# Altium schematic sheet 11_MEM_HYPERRAM_FLASH.SchDoc
size A3; DocumentNumber: 11; SheetNumber: 11; SheetTotal: 21
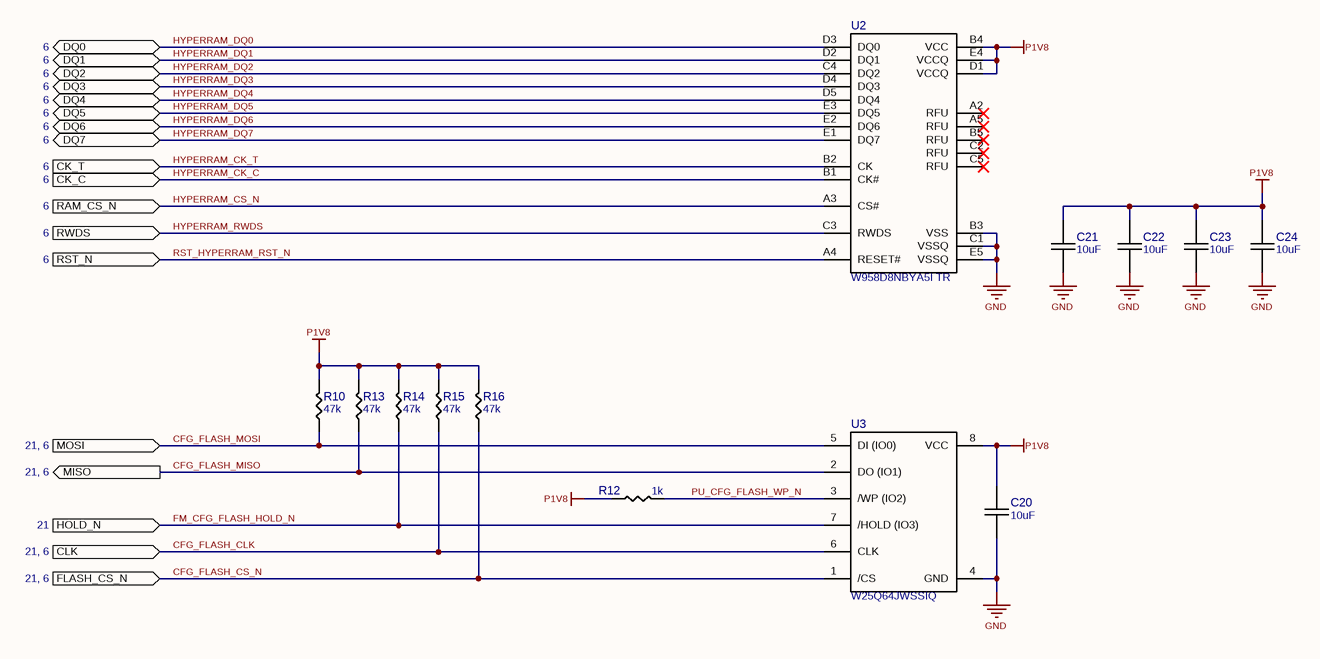
[diagram p0: 11_MEM_HYPERRAM_FLASH.SchDoc]

## Parts
C20  10uF  [CAPC1005X06N]
C21  10uF  [CAPC1005X06N]
C22  10uF  [CAPC1005X06N]
C23  10uF  [CAPC1005X06N]
C24  10uF  [CAPC1005X06N]
R10  47k  [RESC1005X03N]
R12  1k  [RESC1005X03N]
R13  47k  [RESC1005X03N]
R14  47k  [RESC1005X03N]
R15  47k  [RESC1005X03N]
R16  47k  [RESC1005X03N]
U2  W958D8NBYA5I TR  [BGA24C100P5X5_600X800X120]
U3  W25Q64JWSSIQ  [SOIC127P590X175-8N]

## Ports
CK_C (in, see 6), CK_T (in, see 6), CLK (in, see 21, 6), DQ0 (bidir, see 6), DQ1 (bidir, see 6), DQ2 (bidir, see 6), DQ3 (bidir, see 6), DQ4 (bidir, see 6), DQ5 (bidir, see 6), DQ6 (bidir, see 6), DQ7 (bidir, see 6), FLASH_CS_N (in, see 21, 6), HOLD_N (in, see 21), MISO (out, see 21, 6), MOSI (in, see 21, 6), RAM_CS_N (in, see 6), RST_N (in, see 6), RWDS (in, see 6)

## Nets
GND: C20.1 C21.1 C22.1 C23.1 C24.1 U2.B3(VSS) U2.C1(VSSQ) U2.E5(VSSQ) U3.4(GND)
P1V8: C20.2 C21.2 C22.2 C23.2 C24.2 R10.2 R12.1 R13.2 R14.2 R15.2 R16.2 U2.B4(VCC) U2.D1(VCCQ) U2.E4(VCCQ) U3.8(VCC)
CFG_FLASH_CLK: R15.1 U3.6(CLK) ; port CLK
CFG_FLASH_CS_N: R16.1 U3.1(/CS) ; port FLASH_CS_N
CFG_FLASH_MISO: R13.1 U3.2(DO_(IO1)) ; port MISO
CFG_FLASH_MOSI: R10.1 U3.5(DI_(IO0)) ; port MOSI
FM_CFG_FLASH_HOLD_N: R14.1 U3.7(/HOLD_(IO3)) ; port HOLD_N
HYPERRAM_CK_C: U2.B1(CK#) ; port CK_C
HYPERRAM_CK_T: U2.B2(CK) ; port CK_T
HYPERRAM_CS_N: U2.A3(CS#) ; port RAM_CS_N
HYPERRAM_DQ0: U2.D3(DQ0) ; port DQ0
HYPERRAM_DQ1: U2.D2(DQ1) ; port DQ1
HYPERRAM_DQ2: U2.C4(DQ2) ; port DQ2
HYPERRAM_DQ3: U2.D4(DQ3) ; port DQ3
HYPERRAM_DQ4: U2.D5(DQ4) ; port DQ4
HYPERRAM_DQ5: U2.E3(DQ5) ; port DQ5
HYPERRAM_DQ6: U2.E2(DQ6) ; port DQ6
HYPERRAM_DQ7: U2.E1(DQ7) ; port DQ7
HYPERRAM_RWDS: U2.C3(RWDS) ; port RWDS
PU_CFG_FLASH_WP_N: R12.2 U3.3(/WP_(IO2))
RST_HYPERRAM_RST_N: U2.A4(RESET#) ; port RST_N

Not connected (* = marked no-connect by the designer): U2 A2(RFU)* A5(RFU)* B5(RFU)* C2(RFU)* C5(RFU)*

## Library data of the parts
C20-C24 = GRM155R60J106ME47D: CAP CER 10UF 6.3V X5R 0402; Manufacturer 1: Murata Electronics; Tol: 20%; Part Number: GRM155R60J106ME47D; Value: 10uF; Voltage: 6.3V; TempC: X5R; Manufacturer Part Number 1: GRM155R60J106ME47D; Supplier 1: Digi-Key; Supplier Part Number 1: 490-13239-1-ND
R10 R13-R16 = RC0402FR-0747KL: RES SMD 47K OHM 1% 1/16W 0402; Manufacturer 1: Yageo; Part Number: RC0402FR-0747KL; Value: 47k; Tol: 1%; Manufacturer Part Number 1: RC0402FR-0747KL; Supplier 1: Digi-Key; Supplier Part Number 1: 311-47.0KLRCT-ND
R12 = RC0402FR-071KL: RES SMD 1K OHM 1% 1/16W 0402; Manufacturer 1: Yageo; Part Number: RC0402FR-071KL; Value: 1k; Tol: 1%; Manufacturer Part Number 1: RC0402FR-071KL; Supplier 1: Digi-Key; Supplier Part Number 1: 311-1.00KLRCT-ND
U2 = W958D8NBYA5I TR: 256MB HYPERRAM X8, 200MHZ, IND T; Manufacturer 1: Winbond Electronics; Part Number: W958D8NBYA5I TR; Manufacturer Part Number 1: W958D8NBYA5I TR; Supplier 1: Digi-Key; Supplier Part Number 1: 256-W958D8NBYA5ITRCT-ND
U3 = W25Q64JWSSIQ: IC FLASH 64MBIT SPI/QUAD 8SOIC; Manufacturer 1: Winbond Electronics; Part Number: W25Q64JWSSIQ; Manufacturer Part Number 1: W25Q64JWSSIQ; Supplier 1: Digi-Key; Supplier Part Number 1: 256-W25Q64JWSSIQ-ND